# Altium schematic sheet Sheet1.SchDoc
size A4
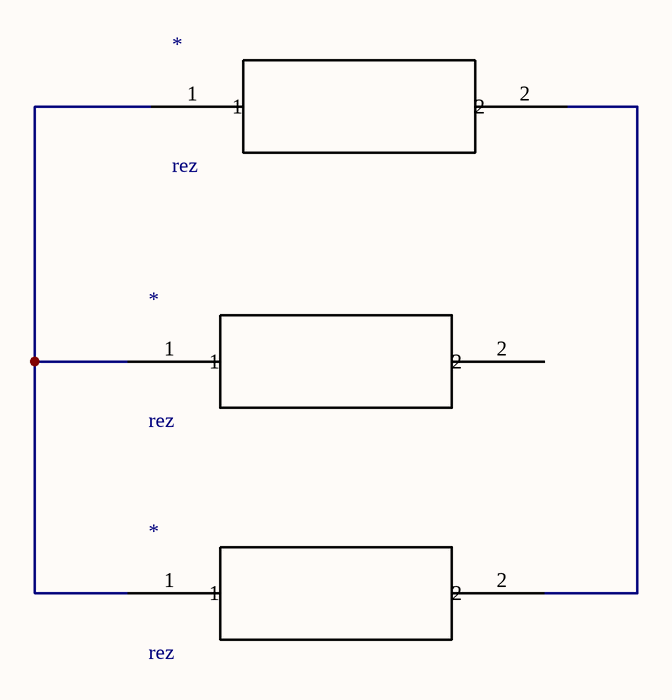
[diagram p0: Sheet1.SchDoc]

## Parts
(Parts that share a designator on the sheet are numbered #1, #2 ... from top to bottom, then left to right.)
*#1  rez  [rez]
*#2  rez  [rez]
*#3  rez  [rez]

## Nets
Net*#1_1: *#1.1 *#2.1 *#3.1
Net*#1_2: *#1.2 *#3.2

Not connected (* = marked no-connect by the designer): *#2 2